# EAGLE design picotouch_synth_flip (EAGLE 9.6.2)
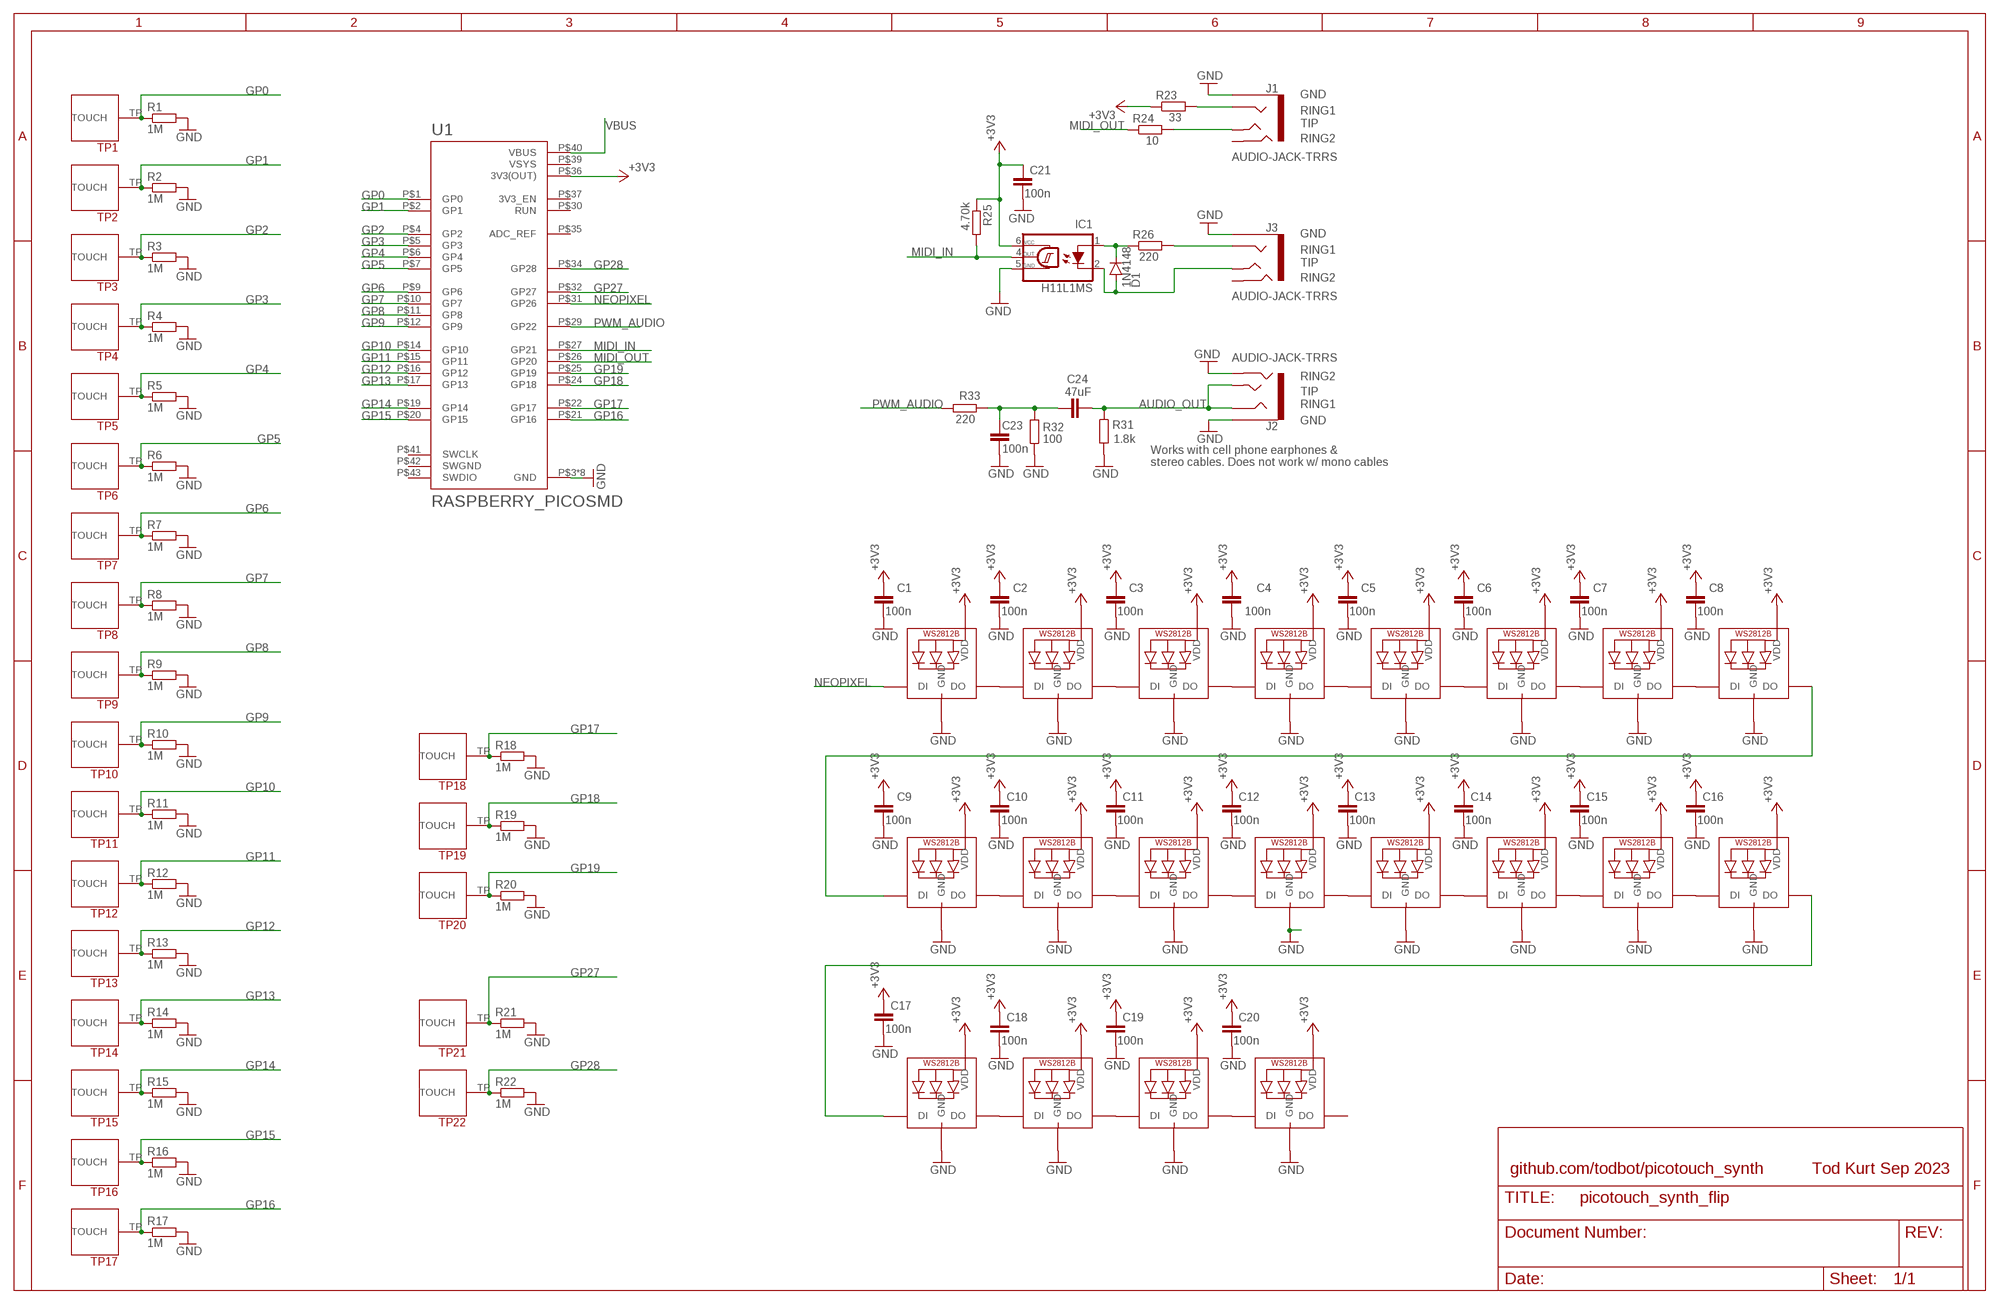
[diagram p0: schematic, sheet 1]

## Parts
C1  100n  C-EUC0603  [C0603]
C2  100n  C-EUC0603  [C0603]
C3  100n  C-EUC0603  [C0603]
C4  100n  C-EUC0603  [C0603]
C5  100n  C-EUC0603  [C0603]
C6  100n  C-EUC0603  [C0603]
C7  100n  C-EUC0603  [C0603]
C8  100n  C-EUC0603  [C0603]
C9  100n  C-EUC0603  [C0603]
C10  100n  C-EUC0603  [C0603]
C11  100n  C-EUC0603  [C0603]
C12  100n  C-EUC0603  [C0603]
C13  100n  C-EUC0603  [C0603]
C14  100n  C-EUC0603  [C0603]
C15  100n  C-EUC0603  [C0603]
C16  100n  C-EUC0603  [C0603]
C17  100n  C-EUC0603  [C0603]
C18  100n  C-EUC0603  [C0603]
C19  100n  C-EUC0603  [C0603]
C20  100n  C-EUC0603  [C0603]
C21  100n  C-EUC0603  [C0603]
C23  100n  C-EUC0603  [C0603]
C24  47uF  C-EUC0603  [C0603]
D1  1N4148  DIODE-SOD123  [SOD123]
IC1  H11L1MS  [DIL6-SMD]
J1  AUDIO-JACK-TRRS  [PJ-320D_SPARKFUN]
J2  AUDIO-JACK-TRRS  [PJ-320D_SPARKFUN]
J3  AUDIO-JACK-TRRS  [PJ-320D_SPARKFUN]
LED1  MICROBUILDER_WS2812B_SK6812E  [MICROBUILDER_NEO3535_REVERSE]
LED2  MICROBUILDER_WS2812B_SK6812E  [MICROBUILDER_NEO3535_REVERSE]
LED3  MICROBUILDER_WS2812B_SK6812E  [MICROBUILDER_NEO3535_REVERSE]
LED4  MICROBUILDER_WS2812B_SK6812E  [MICROBUILDER_NEO3535_REVERSE]
LED5  MICROBUILDER_WS2812B_SK6812E  [MICROBUILDER_NEO3535_REVERSE]
LED6  MICROBUILDER_WS2812B_SK6812E  [MICROBUILDER_NEO3535_REVERSE]
LED7  MICROBUILDER_WS2812B_SK6812E  [MICROBUILDER_NEO3535_REVERSE]
LED8  MICROBUILDER_WS2812B_SK6812E  [MICROBUILDER_NEO3535_REVERSE]
LED9  MICROBUILDER_WS2812B_SK6812E  [MICROBUILDER_NEO3535_REVERSE]
LED10  MICROBUILDER_WS2812B_SK6812E  [MICROBUILDER_NEO3535_REVERSE]
LED11  MICROBUILDER_WS2812B_SK6812E  [MICROBUILDER_NEO3535_REVERSE]
LED12  MICROBUILDER_WS2812B_SK6812E  [MICROBUILDER_NEO3535_REVERSE]
LED13  MICROBUILDER_WS2812B_SK6812E  [MICROBUILDER_NEO3535_REVERSE]
LED14  MICROBUILDER_WS2812B_SK6812E  [MICROBUILDER_NEO3535_REVERSE]
LED15  MICROBUILDER_WS2812B_SK6812E  [MICROBUILDER_NEO3535_REVERSE]
LED16  MICROBUILDER_WS2812B_SK6812E  [MICROBUILDER_NEO3535_REVERSE]
LED17  MICROBUILDER_WS2812B_SK6812E  [MICROBUILDER_NEO3535_REVERSE]
LED18  MICROBUILDER_WS2812B_SK6812E  [MICROBUILDER_NEO3535_REVERSE]
LED19  MICROBUILDER_WS2812B_SK6812E  [MICROBUILDER_NEO3535_REVERSE]
LED20  MICROBUILDER_WS2812B_SK6812E  [MICROBUILDER_NEO3535_REVERSE]
R1  1M  R-EU_R0805  [R0805]
R2  1M  R-EU_R0805  [R0805]
R3  1M  R-EU_R0805  [R0805]
R4  1M  R-EU_R0805  [R0805]
R5  1M  R-EU_R0805  [R0805]
R6  1M  R-EU_R0805  [R0805]
R7  1M  R-EU_R0805  [R0805]
R8  1M  R-EU_R0805  [R0805]
R9  1M  R-EU_R0805  [R0805]
R10  1M  R-EU_R0805  [R0805]
R11  1M  R-EU_R0805  [R0805]
R12  1M  R-EU_R0805  [R0805]
R13  1M  R-EU_R0805  [R0805]
R14  1M  R-EU_R0805  [R0805]
R15  1M  R-EU_R0805  [R0805]
R16  1M  R-EU_R0805  [R0805]
R17  1M  R-EU_R0805  [R0805]
R18  1M  R-EU_R0603  [R0603]
R19  1M  R-EU_R0603  [R0603]
R20  1M  R-EU_R0603  [R0603]
R21  1M  R-EU_R0603  [R0603]
R22  1M  R-EU_R0603  [R0603]
R23  33  R-EU_R0603  [R0603]
R24  10  R-EU_R0603  [R0603]
R25  4.70k  R-EU_R0603  [R0603]
R26  220  R-EU_R0603  [R0603]
R31  1.8k  R-EU_R0603  [R0603]
R32  100  R-EU_R0603  [R0603]
R33  220  R-EU_R0603  [R0603]
TP1  TOUCHPADA  [TOUCHPADA]
TP2  TOUCHPADA  [TOUCHPADA]
TP3  TOUCHPADA  [TOUCHPADA]
TP4  TOUCHPADA  [TOUCHPADA]
TP5  TOUCHPADA  [TOUCHPADA]
TP6  TOUCHPADA  [TOUCHPADA]
TP7  TOUCHPADA  [TOUCHPADA]
TP8  TOUCHPADA  [TOUCHPADA]
TP9  TOUCHPADA  [TOUCHPADA]
TP10  TOUCHPADA  [TOUCHPADA]
TP11  TOUCHPADA  [TOUCHPADA]
TP12  TOUCHPADA  [TOUCHPADA]
TP13  TOUCHPADA  [TOUCHPADA]
TP14  TOUCHPADA  [TOUCHPADA]
TP15  TOUCHPADA  [TOUCHPADA]
TP16  TOUCHPADA  [TOUCHPADA]
TP17  TOUCHPADA  [TOUCHPADA]
TP18  TOUCHPADB  [TOUCHPADB]
TP19  TOUCHPADB  [TOUCHPADB]
TP20  TOUCHPADB  [TOUCHPADB]
TP21  TOUCHPADB  [TOUCHPADB]
TP22  TOUCHPADB  [TOUCHPADB]
U1  RASPBERRY_PICOSMD  [PICO-PKG-SMD]

## Nets
+3V3: C1.1 C2.1 C3.1 C4.1 C5.1 C6.1 C7.1 C8.1 C9.1 C10.1 C11.1 C12.1 C13.1 C14.1 C15.1 C16.1 C17.1 C18.1 C19.1 C20.1 C21.1 IC1.6(VCC) LED1.1-VDD(VDD) LED2.1-VDD(VDD) LED3.1-VDD(VDD) LED4.1-VDD(VDD) LED5.1-VDD(VDD) LED6.1-VDD(VDD) LED7.1-VDD(VDD) LED8.1-VDD(VDD) LED9.1-VDD(VDD) LED10.1-VDD(VDD) LED11.1-VDD(VDD) LED12.1-VDD(VDD) LED13.1-VDD(VDD) LED14.1-VDD(VDD) LED15.1-VDD(VDD) LED16.1-VDD(VDD) LED17.1-VDD(VDD) LED18.1-VDD(VDD) LED19.1-VDD(VDD) LED20.1-VDD(VDD) R23.1 R25.1 U1.P$36(3V3(OUT))
AUDIO_OUT: C24.2 J2.RING1 J2.TIP R31.1
GND: C1.2 C2.2 C3.2 C4.2 C5.2 C6.2 C7.2 C8.2 C9.2 C10.2 C11.2 C12.2 C13.2 C14.2 C15.2 C16.2 C17.2 C18.2 C19.2 C20.2 C21.2 C23.2 IC1.5(GND) J1.EARTH J2.EARTH J2.RING2 J3.EARTH LED1.3-GND(GND) LED2.3-GND(GND) LED3.3-GND(GND) LED4.3-GND(GND) LED5.3-GND(GND) LED6.3-GND(GND) LED7.3-GND(GND) LED8.3-GND(GND) LED9.3-GND(GND) LED10.3-GND(GND) LED11.3-GND(GND) LED12.3-GND(GND) LED13.3-GND(GND) LED14.3-GND(GND) LED15.3-GND(GND) LED16.3-GND(GND) LED17.3-GND(GND) LED18.3-GND(GND) LED19.3-GND(GND) LED20.3-GND(GND) R1.2 R2.2 R3.2 R4.2 R5.2 R6.2 R7.2 R8.2 R9.2 R10.2 R11.2 R12.2 R13.2 R14.2 R15.2 R16.2 R17.2 R18.2 R19.2 R20.2 R21.2 R22.2 R31.2 R32.1 U1.P$3(GND) U1.P$8(GND) U1.P$13(GND) U1.P$18(GND) U1.P$23(GND) U1.P$28(GND) U1.P$33(GND) U1.P$38(GND)
GP0: R1.1 TP1.TP(TOUCH) U1.P$1(GP0)
GP1: R2.1 TP2.TP(TOUCH) U1.P$2(GP1)
GP2: R3.1 TP3.TP(TOUCH) U1.P$4(GP2)
GP3: R4.1 TP4.TP(TOUCH) U1.P$5(GP3)
GP4: R5.1 TP5.TP(TOUCH) U1.P$6(GP4)
GP5: R6.1 TP6.TP(TOUCH) U1.P$7(GP5)
GP6: R7.1 TP7.TP(TOUCH) U1.P$9(GP6)
GP7: R8.1 TP8.TP(TOUCH) U1.P$10(GP7)
GP8: R9.1 TP9.TP(TOUCH) U1.P$11(GP8)
GP9: R10.1 TP10.TP(TOUCH) U1.P$12(GP9)
GP10: R11.1 TP11.TP(TOUCH) U1.P$14(GP10)
GP11: R12.1 TP12.TP(TOUCH) U1.P$15(GP11)
GP12: R13.1 TP13.TP(TOUCH) U1.P$16(GP12)
GP13: R14.1 TP14.TP(TOUCH) U1.P$17(GP13)
GP14: R15.1 TP15.TP(TOUCH) U1.P$19(GP14)
GP15: R16.1 TP16.TP(TOUCH) U1.P$20(GP15)
GP16: R17.1 TP17.TP(TOUCH) U1.P$21(GP16)
GP17: R18.1 TP18.TP(TOUCH) U1.P$22(GP17)
GP18: R19.1 TP19.TP(TOUCH) U1.P$24(GP18)
GP19: R20.1 TP20.TP(TOUCH) U1.P$25(GP19)
GP27: R21.1 TP21.TP(TOUCH) U1.P$32(GP27)
GP28: R22.1 TP22.TP(TOUCH) U1.P$34(GP28)
MIDI_IN: IC1.4(OUT) R25.2 U1.P$27(GP21)
MIDI_OUT: R24.1 U1.P$26(GP20)
N$1: D1.C IC1.1(A) R26.1
N$2: J1.TIP R24.2
N$3: D1.A IC1.2(C) J3.TIP
N$4: J3.RING1 R26.2
N$5: C23.1 C24.1 R32.2 R33.1
N$6: J1.RING1 R23.2
N$7: LED1.2-DOUT(DO) LED2.4-DIN(DI)
N$8: LED2.2-DOUT(DO) LED3.4-DIN(DI)
N$9: LED4.2-DOUT(DO) LED5.4-DIN(DI)
N$10: LED5.2-DOUT(DO) LED6.4-DIN(DI)
N$11: LED6.2-DOUT(DO) LED7.4-DIN(DI)
N$12: LED7.2-DOUT(DO) LED8.4-DIN(DI)
N$13: LED9.2-DOUT(DO) LED10.4-DIN(DI)
N$14: LED10.2-DOUT(DO) LED11.4-DIN(DI)
N$15: LED12.2-DOUT(DO) LED13.4-DIN(DI)
N$16: LED13.2-DOUT(DO) LED14.4-DIN(DI)
N$17: LED14.2-DOUT(DO) LED15.4-DIN(DI)
N$18: LED15.2-DOUT(DO) LED16.4-DIN(DI)
N$19: LED3.2-DOUT(DO) LED4.4-DIN(DI)
N$20: LED11.2-DOUT(DO) LED12.4-DIN(DI)
N$21: LED8.2-DOUT(DO) LED9.4-DIN(DI)
N$22: LED16.2-DOUT(DO) LED17.4-DIN(DI)
N$23: LED17.2-DOUT(DO) LED18.4-DIN(DI)
N$24: LED18.2-DOUT(DO) LED19.4-DIN(DI)
N$25: LED19.2-DOUT(DO) LED20.4-DIN(DI)
NEOPIXEL: LED1.4-DIN(DI) U1.P$31(GP26)
PWM_AUDIO: R33.2 U1.P$29(GP22)
VBUS: U1.P$40(VBUS)
Unconnected: J1.RING2 J3.RING2 LED20.2-DOUT(DO) U1.P$30(RUN) U1.P$35(ADC_REF) U1.P$37(3V3_EN) U1.P$41(SWCLK) U1.P$43(SWDIO)

## Notes on the sheet
- GND
- RING1
- TIP
- RING2
- GND
- RING1
- TIP
- RING2
- RING2
- TIP
- RING1
- GND
- Works with cell phone earphones &
  stereo cables. Does not work w/ mono cables
- github.com/todbot/picotouch_synth | Tod Kurt Sep 2023

## Power pins joined to a net without a drawn wire
SWGND: U1.P$42(SWGND)
VSYS: U1.P$39(VSYS)

## Library data of the parts
C1-C21 C23 C24 = rcl:C-EU: CAPACITOR, European symbol; SPICEPREFIX: C
D1 = diode:DIODE-: DIODE
IC1 = optocoupler:H11L*M: 6-Pin DIP Optocoupler Source: http://www.fairchildsemi.com/ds/H1/H11L2-M.pdf; LCSC: C78589; MPN2: H11L1S; OC_FARNELL: unknown; OC_NEWARK: unknown
J1-J3 = audio_jacks_todbot:AUDIO-JACK-TRRS; LCSC: C431535; MPN: PJ-320D
LED1-LED20 = Adafruit MacroPad 2040:MICROBUILDER_WS2812B
R1-R26 R31-R33 = rcl:R-EU_: RESISTOR, European symbol; SPICEPREFIX: R
TP1-TP22 = todstuff:TOUCHPAD
U1 = RpiPico:RASPBERRY_PICO: Raspberry Pi Pico

## Net classes
1 power: width 0.305 mm

## Board
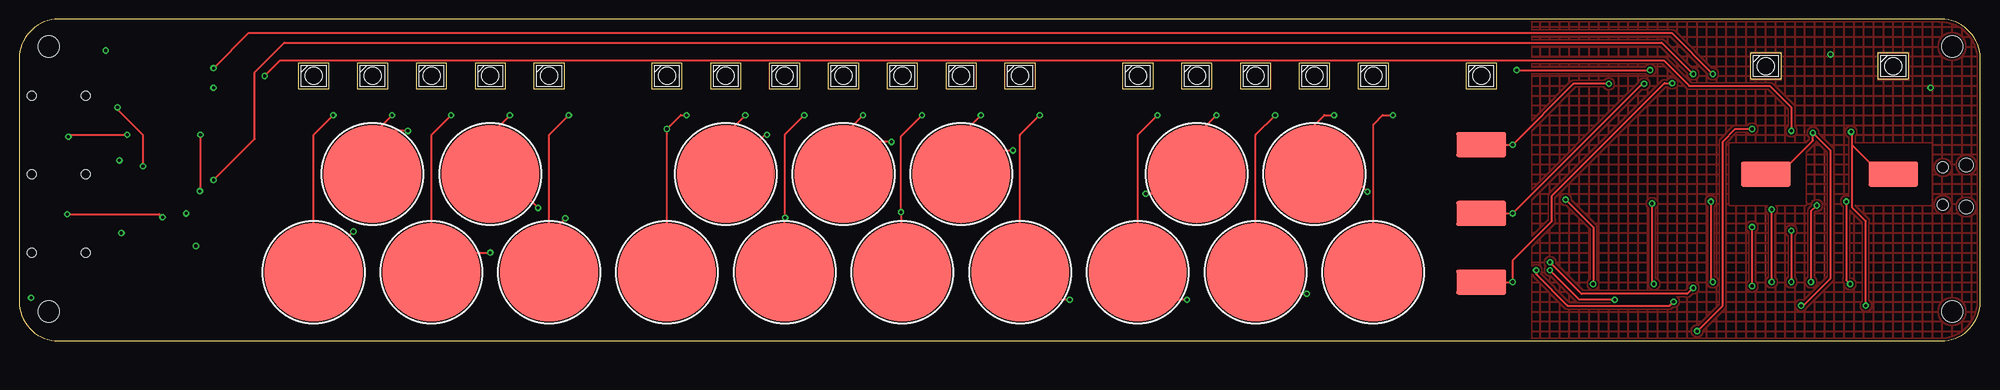
[diagram p1: board, top side]
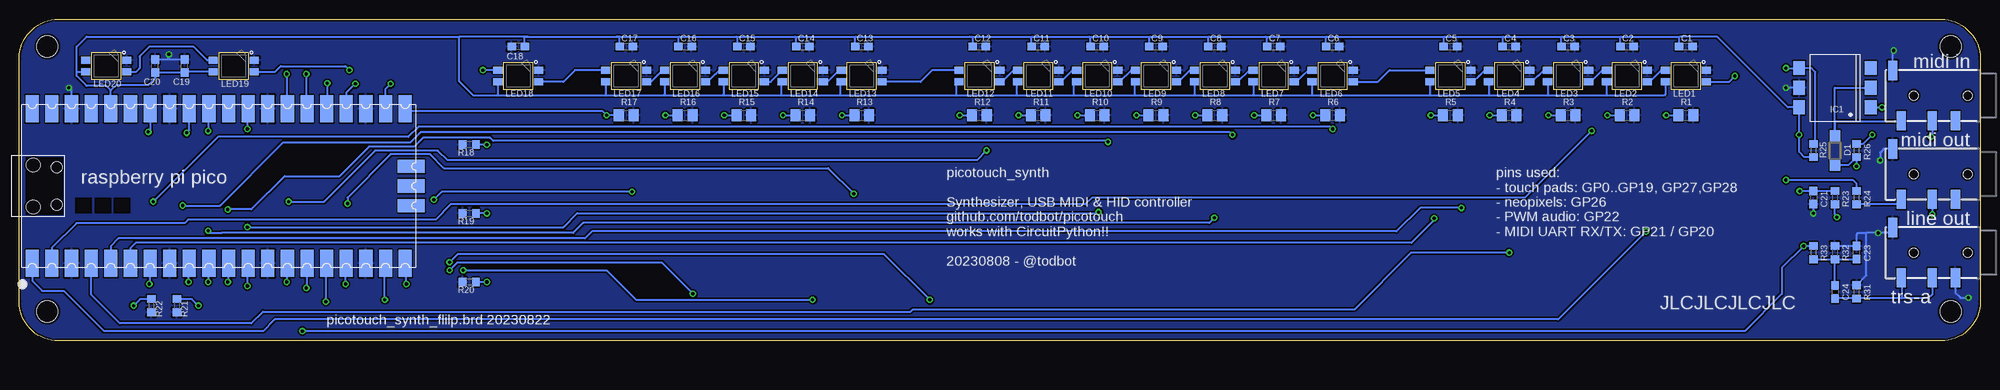
[diagram p2: board, bottom side, seen from below]

Size 253.81 x 41.62 mm. Coordinates in mm from the lower left corner, seen from the top.
Outline: 248.73,41.62 5.08,41.62 arc90 0,36.54 0,5.08 arc90 5.08,0 248.73,0 arc90 253.81,5.08 253.81,36.54 arc90 248.73,41.62
Copper layers (1*16): Top 0.035mm / dielectric 1.5mm / Bottom 0.035mm
Design rules "adafruit-rules-20180530 *": minimum track width 10mil, minimum drill 16mil, track to track 8mil, track to pad 8mil, pad to pad 8mil, via to via 8mil, smd to smd 8mil, copper to edge 10mil, drill to drill 8mil, minimum pad ring 10mil, minimum via ring 8mil, stop-mask expansion 4mil, vias tented up to drill 20mil, thermal gap 10mil
Holes 2.79 mm at 250.19,38.1 250.19,3.81 3.81,38.1 3.81,3.81
tRestrict: area 237.7,17.8 to 247.4,25.4; area 221.5,17.8 to 231.1,25.4

### Footprints (pad centres in the part's own frame; a part is rotated, then mirrored left to right if it is on the bottom)
C0603 = smd 1.1 x 1: 1 -0.85,0; 2 0.85,0
SOD123 = smd 1.4 x 1.4: A 1.9,0; C -1.9,0
DIL6-SMD = smd 1.78 x 1.52: 1 -2.54,-4.645; 2 0,-4.645; 3 2.54,-4.645; 4 2.54,4.645; 5 0,4.645; 6 -2.54,4.645
PJ-320D_SPARKFUN = smd 1.2 x 2.5: EARTH 11.3,-3.25; RING1 6.2,3.25; RING2 3.2,3.25; TIP 10.2,3.25 | hole 1.2: 1.6,0; 8.6,0
MICROBUILDER_NEO3535_REVERSE = smd 1.2 x 0.9 bottom: 1-VDD 2.65,-0.75; 2-DOUT 2.65,0.75; 3-GND -2.65,0.75; 4-DIN -2.65,-0.75
R0805 = smd 1.3 x 1.5: 1 -0.95,0; 2 0.95,0
R0603 = smd 1 x 1.1: 1 -0.85,0; 2 0.85,0
TOUCHPADA = smd 12.7 x 12.7: TP 0,0
TOUCHPADB = smd 6.452 x 3.251: TP 0,0
PICO-PKG-SMD = smd 3.5 x 1.7: P$1 -10,24.13; P$2 -10,21.59; P$3 -10,19.05; P$4 -10,16.51; P$5 -10,13.97; P$6 -10,11.43; P$7 -10,8.89; P$8 -10,6.35; P$9 -10,3.81; P$10 -10,1.27; P$11 -10,-1.27; P$12 -10,-3.81; P$13 -10,-6.35; P$14 -10,-8.89; P$15 -10,-11.43; P$16 -10,-13.97; P$17 -10,-16.51; P$18 -10,-19.05; P$19 -10,-21.59; P$20 -10,-24.13; P$21 10,-24.13; P$22 10,-21.59; P$23 10,-19.05; P$24 10,-16.51; P$25 10,-13.97; P$26 10,-11.43; P$27 10,-8.89; P$28 10,-6.35; P$29 10,-3.81; P$30 10,-1.27; P$31 10,1.27; P$32 10,3.81; P$33 10,6.35; P$34 10,8.89; P$35 10,11.43; P$36 10,13.97; P$37 10,16.51; P$38 10,19.05; P$39 10,21.59; P$40 10,24.13 | smd 1.7 x 3.5: P$41 -2.54,-24.925; P$42 0,-24.925; P$43 2.54,-24.925 | hole 1.8: -2.725,24; 2.725,24 | hole 1.5: -2.425,20.97; 2.425,20.97

### Placement (x,y rotation side)
C1  38.1,38.1 0 bottom
C2  45.72,38.1 0 bottom
C3  53.34,38.1 0 bottom
C4  60.96,38.1 0 bottom
C5  68.58,38.1 0 bottom
C6  83.82,38.1 0 bottom
C7  91.44,38.1 0 bottom
C8  99.06,38.1 0 bottom
C9  106.68,38.1 0 bottom
C10  114.3,38.1 0 bottom
C11  121.92,38.1 0 bottom
C12  129.54,38.1 0 bottom
C13  144.78,38.1 0 bottom
C14  152.4,38.1 0 bottom
C15  160.02,38.1 0 bottom
C16  167.64,38.1 0 bottom
C17  175.26,38.1 0 bottom
C18  189.23,38.1 180 bottom
C19  232.41,35.56 90 bottom
C20  236.22,35.56 90 bottom
C21  21.59,18.54 270 bottom
C23  16,11.43 90 bottom
C24  18.8,6.35 270 bottom
D1  18.8,24.64 90 bottom
IC1  18.8,32.77 90 bottom
J1  0,21.59 180 bottom
J2  0,11.43 180 bottom
J3  0,31.75 180 bottom
LED1  38.1,34.29 0 top
LED2  45.72,34.29 0 top
LED3  53.34,34.29 0 top
LED4  60.96,34.29 0 top
LED5  68.58,34.29 0 top
LED6  83.82,34.29 0 top
LED7  91.44,34.29 0 top
LED8  99.06,34.29 0 top
LED9  106.68,34.29 0 top
LED10  114.3,34.29 0 top
LED11  121.92,34.29 0 top
LED12  129.54,34.29 0 top
LED13  144.78,34.29 0 top
LED14  152.4,34.29 0 top
LED15  160.02,34.29 0 top
LED16  167.64,34.29 0 top
LED17  175.26,34.29 0 top
LED18  189.23,34.29 0 top
LED19  226.06,35.56 0 top
LED20  242.57,35.56 0 top
R1  38.1,29.21 0 bottom
R2  45.72,29.21 0 bottom
R3  53.34,29.21 0 bottom
R4  60.96,29.21 0 bottom
R5  68.58,29.21 0 bottom
R6  83.82,29.21 0 bottom
R7  91.44,29.21 0 bottom
R8  99.06,29.21 0 bottom
R9  106.68,29.21 0 bottom
R10  114.3,29.21 0 bottom
R11  121.92,29.21 0 bottom
R12  129.54,29.21 0 bottom
R13  144.78,29.21 0 bottom
R14  152.4,29.21 0 bottom
R15  160.02,29.21 0 bottom
R16  167.64,29.21 0 bottom
R17  175.26,29.21 0 bottom
R18  195.58,25.4 180 bottom
R19  195.58,16.51 180 bottom
R20  195.58,7.62 180 bottom
R21  233.43,4.57 270 bottom
R22  236.73,4.57 270 bottom
R23  18.8,18.54 270 bottom
R24  16,18.54 270 bottom
R25  21.59,24.64 90 bottom
R26  16,24.64 90 bottom
R31  16,6.35 90 bottom
R32  18.8,11.43 270 bottom
R33  21.59,11.43 90 bottom
TP1  38.1,8.89 0 top
TP2  45.72,21.59 0 top
TP3  53.34,8.89 0 top
TP4  60.96,21.59 0 top
TP5  68.58,8.89 0 top
TP6  83.82,8.89 0 top
TP7  91.44,21.59 0 top
TP8  99.06,8.89 90 top
TP9  106.68,21.59 0 top
TP10  114.3,8.89 0 top
TP11  121.92,21.59 0 top
TP12  129.54,8.89 0 top
TP13  144.78,8.89 0 top
TP14  152.4,21.59 0 top
TP15  160.02,8.89 0 top
TP16  167.64,21.59 0 top
TP17  175.26,8.89 0 top
TP18  189.23,25.4 0 top
TP19  189.23,16.51 0 top
TP20  189.23,7.62 0 top
TP21  226.06,21.59 0 top
TP22  242.57,21.59 0 top
U1  228,20.05 90 bottom

### Tracks (layer width: path | path; a pad name or v marks a point on that pad's centre or on a via)
+3V3  (via drill 0.41)
  Top 0.254: v23.44,26.67 23.44,19.46 v23.37,19.39
  Bottom 0.254: 48.26,31.75 44.7,31.75 40.89,31.75 40.75,31.89 LED1.1-VDD | 48.26,31.75 52.07,31.75 55.88,31.75 | 63.5,31.75 59.69,31.75 55.88,31.75 | 63.5,31.75 67.31,31.75 71.12,31.75 | 71.12,31.75 82.55,31.75 86.36,31.75 | 86.36,31.75 90.17,31.75 93.98,31.75 | 93.98,31.75 97.79,31.75 101.6,31.75 | 101.6,31.75 105.41,31.75 109.47,31.75 | 109.47,31.75 113.03,31.75 117.35,31.75 | 117.35,31.75 124.71,31.75 | 124.71,31.75 132.59,31.75 | 162.56,31.75 166.37,31.75 170.18,31.75 | 170.18,31.75 173.99,31.75 177.8,31.75 | 177.8,31.75 191.77,31.75 | 191.77,31.75 194.98,31.75 196.85,33.62 196.85,39.37 | R23.1 C21.1 v23.37,19.39 | R25.1 22.77,23.79 23.44,24.46 v23.44,26.67 IC1.6 24.89,30.23 29.72,35.05 34.04,39.37 38.86,39.37 | C18.1 188.38,39.37 187.96,39.37 | 187.96,39.37 176.53,39.37 | 176.53,39.37 168.4,39.37 | 168.4,39.37 161.04,39.37 | 161.04,39.37 153.42,39.37 | 153.42,39.37 145.54,39.37 | 145.54,39.37 130.81,39.37 130.56,39.37 | 130.56,39.37 122.68,39.37 | 122.68,39.37 115.32,39.37 | 115.32,39.37 107.44,39.37 | 107.44,39.37 99.82,39.37 | 99.82,39.37 92.46,39.37 | 92.46,39.37 84.58,39.37 | 84.58,39.37 69.34,39.37 | 69.34,39.37 61.72,39.37 | 61.72,39.37 54.1,39.37 | 54.1,39.37 46.48,39.37 | 46.48,39.37 38.86,39.37 | C17.1 176.11,39.37 176.53,39.37 | LED20.1-VDD 246.38,34.81 246.38,35.56 | 187.96,39.37 196.85,39.37 | 196.85,39.37 245.11,39.37 246.38,38.1 246.38,35.56 | U1.P$36 241.97,32.42 | 241.97,32.42 242.22,32.67 242.57,33.02 245.11,33.02 246.38,34.29 246.38,35.56 | C1.1 38.95,39.28 38.86,39.37 | C2.1 46.57,39.28 46.48,39.37 | C3.1 54.19,39.28 54.1,39.37 | C4.1 61.81,39.28 61.72,39.37 | C5.1 69.43,39.28 69.34,39.37 | C13.1 145.63,39.28 145.54,39.37
  Bottom 0.254: C14.1 153.25,39.2 153.42,39.37 | C16.1 168.49,39.28 168.4,39.37 | C15.1 160.87,39.2 161.04,39.37 | LED18.1-VDD 191.88,31.86 191.77,31.75 | LED17.1-VDD 177.91,31.86 177.8,31.75 | LED16.1-VDD 170.29,31.86 170.18,31.75 | LED15.1-VDD 162.67,31.86 162.56,31.75 | LED4.1-VDD 63.61,31.86 63.5,31.75 | LED3.1-VDD 55.99,31.86 55.88,31.75 | LED2.1-VDD 48.37,31.86 48.26,31.75 | LED5.1-VDD 71.23,31.86 71.12,31.75 | LED6.1-VDD 86.47,31.86 86.36,31.75 | LED7.1-VDD 94.09,31.86 93.98,31.75 | LED8.1-VDD 101.71,31.86 101.6,31.75 | C8.1 99.91,39.28 99.82,39.37 | C7.1 92.29,39.2 92.46,39.37 | C10.1 115.15,39.2 115.32,39.37 | C6.1 84.67,39.28 84.58,39.37 | LED9.1-VDD 109.47,33.4 109.47,31.75 | LED10.1-VDD 117.35,33.14 117.35,31.75 | LED11.1-VDD 124.71,33.4 124.71,31.75 | LED12.1-VDD 132.59,33.14 132.59,31.75 | C12.1 130.39,39.2 130.56,39.37 | C11.1 122.77,39.28 122.68,39.37 | C9.1 107.53,39.28 107.44,39.37 | 132.59,31.75 147.57,31.75 | 147.57,31.75 155.19,31.75 | 155.19,31.75 162.56,31.75 | LED13.1-VDD 147.57,33.4 147.57,31.75 | LED14.1-VDD 155.19,33.4 155.19,31.75 | LED19.1-VDD 232.31,34.81 C19.1 C20.1 236.22,34.01 237.05,33.18 241.21,33.18 241.97,32.42
AUDIO_OUT
  Bottom 0.254: J2.RING1 6.2,5.99 6.69,5.5 10.16,5.5 | J2.TIP 10.16,8.14 10.16,5.5 | 10.16,5.5 R31.1 C24.2
GND  (via drill 0.41)
  Bottom 0.254: J2.EARTH 11.3,14.1 11.43,13.97 14.73,13.97 | R32.1 C23.2 16,13.72 15.75,13.97 14.73,13.97 | J3.EARTH 11.3,37.59 v11.18,37.59 | J2.RING2 3.2,6.25 2.54,5.59 v1.52,5.59 | R31.2 14.73,8.47 14.73,13.97 | IC1.5 v25.15,32.77 | C21.2 v21.59,16.51 | U1.P$38 247.05,32.42 v247.4,32.77 | C19.2 234.44,36.41 | 234.44,36.41 C20.2 | 234.44,36.41 v234.44,37.08 | J1.EARTH 12.5,24.84 12.95,24.38 v12.95,23.37
  other vias: 13.21,13.97
  pour Top (hatched): 195.85,43.13 254.02,43.13 254.02,-0.73 195.85,-0.73
  pour Bottom: 0,44.45 255.27,44.45 255.27,-2.54 0,-2.54
GP0  (via drill 0.41)
  Top 0.254: v43.24,14.16 38.03,8.96 TP1.TP 38.1,26.67 v40.64,29.21
  Bottom 0.254: v43.24,14.16 54.61,2.79 220.73,2.79 222.25,1.27 242.82,1.27 248.05,6.49 250.86,6.49 252.13,7.76 U1.P$1 | v40.64,29.21 R1.1
GP1  (via drill 0.41)
  Top 0.254: v50.29,27.18 48.26,27.18 45.72,24.64 TP2.TP 45.72,26.67 v48.26,29.21
  Bottom 0.254: v50.29,27.18 58.93,18.54 114.96,18.54 115.84,17.66 197.98,17.66 199.95,15.7 231.95,15.7 232.41,15.24 246.38,15.24 249.59,12.03 U1.P$2 | v48.26,29.21 R2.1
GP2  (via drill 0.41)
  Top 0.254: v60.96,11.43 55.88,11.43 TP3.TP 53.34,26.67 v55.88,29.21
  Bottom 0.254: v60.96,11.43 73.66,11.43 81.03,4.06 138.18,4.06 138.43,3.81 222.25,3.81 223.77,2.29 240.79,2.29 244.51,6 U1.P$4 | v55.88,29.21 R3.1
GP3  (via drill 0.41)
  Top 0.254: v67.15,17.21 62.78,21.59 TP4.TP 60.96,26.67 v63.5,29.21
  Bottom 0.254: U1.P$5 241.97,12.28 241,13.26 180.58,13.26 179.68,14.17 75.54,14.17 72.49,17.21 v67.15,17.21 | v63.5,29.21 R4.1
GP4  (via drill 0.41)
  Top 0.254: v70.69,15.87 68.53,13.72 68.77,13.72 68.77,9.08 TP5.TP 68.58,26.67 v71.12,29.21
  Bottom 0.254: v70.69,15.87 70.69,15.61 73.61,12.69 238.76,12.69 239.43,12.02 U1.P$6 | v71.12,29.21 R5.1
GP5  (via drill 0.41)
  Top 0.254: TP6.TP v83.82,27.43 85.6,29.21 v86.36,29.21 | v236.47,18.03 236.47,7.87 v236.98,7.37
  Bottom 0.254: v83.82,27.43 84.13,27.74 202.13,27.74 203.45,26.42 228.09,26.42 v236.47,18.03 | v236.98,7.37 236.89,7.46 U1.P$7 | v86.36,29.21 R6.1
GP6  (via drill 0.41)
  Top 0.254: v232.66,17.53 231.9,16.76 v231.9,7.62 | v93.98,29.21 91.44,26.67 TP7.TP 96.52,26.67 v96.77,26.67
  Bottom 0.254: v96.77,26.67 97.11,27.01 201.85,27.01 203.2,25.65 219.71,25.65 227.84,17.53 v232.66,17.53 | R7.1 92.46,29.28 92.52,29.21 v93.98,29.21 | v231.9,7.62 231.9,9.96 U1.P$9
GP7  (via drill 0.41)
  Top 0.254: TP8.TP 99.06,15.86 v99.13,15.93 99.13,26.74 v101.6,29.21 | v229.36,14.25 v229.36,7.62
  Bottom 0.254: v99.13,15.93 99.77,15.29 180.8,15.29 182.12,13.97 227.58,13.97 229.08,13.97 v229.36,14.25 | v229.36,7.62 229.27,7.71 U1.P$10 | v101.6,29.21 R8.1
GP8  (via drill 0.41)
  Top 0.254: v112.89,25.75 108.87,25.75 106.81,27.81 106.68,27.69 TP9.TP 106.68,26.67 v109.22,29.21 | v226.82,7.62 v226.82,17.02
  Bottom 0.254: v112.89,25.75 113.02,25.88 192.48,25.88 192.88,26.28 201.56,26.28 202.69,25.15 208.53,25.15 212.34,21.34 219.46,21.34 223.77,17.02 v226.82,17.02 | v226.82,7.62 226.73,7.71 U1.P$11 | v109.22,29.21 R9.1
GP9  (via drill 0.41)
  Top 0.254: TP10.TP 114.11,9.08 v114.11,16.67 114.11,26.48 v116.84,29.21 | v224.28,14.73 v224.28,7.11
  Bottom 0.254: R10.1 115.32,29.28 115.38,29.21 v116.84,29.21 | v224.28,14.73 183.39,14.73 181.58,16.54 114.25,16.54 v114.11,16.67 | v224.28,7.11 224.28,9.96 U1.P$12
GP10  (via drill 0.41)
  Top 0.254: v128.61,24.66 124.99,24.66 TP11.TP 121.92,26.67 v124.46,29.21 | v218.95,18.03 218.95,7.87 v219.2,7.62
  Bottom 0.254: v128.61,24.66 129.88,23.39 198.4,23.39 199.64,24.64 207.77,24.64 214.38,18.03 v218.95,18.03 | v219.2,7.62 219.11,7.71 U1.P$14 | v124.46,29.21 R11.1
GP11  (via drill 0.41)
  Top 0.254: v198.13,10.17 202.21,6.1 215.9,6.1 v216.66,6.86 | v135.96,5.32 133.11,5.32 TP12.TP 129.54,26.67 v132.08,29.21
  Bottom 0.254: v135.96,5.32 141.92,11.28 197.03,11.28 v198.13,10.17 | v216.66,6.86 216.57,6.95 U1.P$15 | v132.08,29.21 R12.1
GP12  (via drill 0.41)
  Top 0.254: v196.34,9.14 196.34,8.64 200.41,4.57 213.61,4.57 v214.12,5.08 | v151.13,5.33 148.34,5.33 TP13.TP 144.78,26.67 v147.32,29.21
  Bottom 0.254: v214.12,5.08 214.12,9.96 U1.P$16 | v196.34,9.14 177.8,9.14 173.99,5.33 v151.13,5.33 | v147.32,29.21 R13.1
GP13  (via drill 0.41)
  Top 0.254: 152.4,27.43 152.65,27.69 | 152.65,27.69 152.78,27.81 152.4,27.43 | 152.4,27.43 152.65,27.69 | TP14.TP 152.4,27.43 | TP14.TP 149.86,19.05 v145.8,19.05 | v211.33,17.78 211.33,7.62 v211.58,7.37 | TP14.TP 152.4,26.67 v154.94,29.21
  Bottom 0.254: v145.8,19.05 149.1,22.35 198.88,22.35 200.66,24.13 205.74,24.13 211.33,18.54 v211.33,17.78 | v211.58,7.37 211.58,9.96 U1.P$17 | v154.94,29.21 R14.1
GP14  (via drill 0.41)
  Top 0.254: v166.62,6.1 162.81,6.1 TP15.TP 160.02,26.67 v162.56,29.21 | v198.12,9.14 201.93,5.33 v206.5,5.33
  Bottom 0.254: v206.5,5.33 206.5,9.96 U1.P$19 | v166.62,6.1 170.69,10.16 197.1,10.16 v198.12,9.14 | v162.56,29.21 R15.1
GP15  (via drill 0.41)
  Top 0.254: v174.5,19.3 172.21,21.59 TP16.TP 167.64,27.94 168.91,29.21 v170.18,29.21 | v200.15,18.29 203.71,14.73 v203.71,7.37
  Bottom 0.254: v174.5,19.3 199.14,19.3 v200.15,18.29 | v203.71,7.37 203.71,9.89 U1.P$20 | v170.18,29.21 R16.1
GP16  (via drill 0.41)
  Top 0.254: TP17.TP 175.26,28.01 176.46,29.21 v177.8,29.21
  Bottom 0.254: R17.1 v177.8,29.21 178.31,29.72 203.54,29.72 U1.P$21
GP17  (via drill 0.41)
  Top 0.254: TP18.TP v193.29,25.4 201.17,33.27 v205.74,33.27
  Bottom 0.254: U1.P$22 206.41,32.6 v205.74,33.27 | v193.29,25.4 R18.1
GP18  (via drill 0.41)
  Top 0.254: v210.31,33.27 210.06,33.27 v193.29,16.51 TP19.TP
  Bottom 0.254: v210.31,33.27 211.49,32.1 U1.P$24 | v193.29,16.51 R19.1
GP19  (via drill 0.41)
  Top 0.254: TP20.TP v193.29,7.62 193.29,10.41 198.37,15.49 198.37,18.8 212.93,33.35 v213.95,33.35
  Bottom 0.254: v213.95,33.35 213.95,30.13 U1.P$25 | v193.29,7.62 R20.1
GP27  (via drill 0.41)
  Top 0.254: v230.63,4.57 230.89,4.57 234.44,8.13 234.44,24.64 v232.16,26.92 232.16,25.91 227.84,21.59 TP21.TP
  Bottom 0.254: v230.63,4.57 231.48,5.42 R21.1 | v232.16,26.92 231.81,27.27 U1.P$32
GP28  (via drill 0.41)
  Top 0.254: 237.21,25.4 237.21,26.95 v237.11,27.05 | 237.21,25.4 237.21,17.3 239.01,15.49 v239.01,4.57 | TP22.TP 241.02,21.59 237.21,25.4
  Bottom 0.254: U1.P$34 236.89,27.27 v237.11,27.05 | R22.1 238.16,5.42 v239.01,4.57
MIDI_IN  (via drill 0.41)
  Top 0.254: v25.15,35.31 29.72,39.88 213.87,39.88 v219.2,34.54
  Bottom 0.254: R25.2 21.34,25.74 21.34,34.8 21.84,35.31 IC1.4 v25.15,35.31 | v219.2,34.54 219.2,30.14 U1.P$27
MIDI_OUT  (via drill 0.41)
  Top 0.254: v25.15,20.83 30.48,26.16 30.48,34.8 34.29,38.61 212.6,38.61 v216.66,34.54
  Bottom 0.254: R24.1 16,20.32 16.51,20.83 v25.15,20.83 | v216.66,34.54 216.66,30.14 U1.P$26
N$1  (via drill 0.41)
  Top 0.254: v12.7,30.23 12.7,29.97 16,26.67 v16,22.61
  Bottom 0.254: D1.C 17.05,22.74 R26.1 v16,22.61 | IC1.1 v12.7,30.23
N$2
  Bottom 0.254: J1.TIP 10.85,17.69 R24.2
N$3
  Bottom 0.254: J3.TIP 10.3,28.4 18.71,28.4 18.8,28.32 D1.A 18.8,32.77 IC1.2
N$4  (via drill 0.41)
  Top 0.254: v6.35,26.42 6.6,26.67 v13.97,26.67
  Bottom 0.254: J3.RING1 6.2,26.57 v6.35,26.42 | R26.2 15.15,25.49 v13.97,26.67
N$5
  Bottom 0.254: R33.1 R32.2 | R32.2 C23.1 | C24.1 R32.2
N$6  (via drill 0.41)
  Top 0.254: v6.2,16.41 18.14,16.41 v18.54,16
  Bottom 0.254: J1.RING1 v6.2,16.41 | R23.2 18.8,16.42 18.54,16.17 v18.54,16
N$7
  Bottom 0.254: LED1.2-DOUT 41.27,35.04 42.77,33.54 LED2.4-DIN
N$8
  Bottom 0.254: LED2.2-DOUT 48.88,35.04 49.6,34.32 49.62,34.32 49.97,33.97 50.4,33.54 LED3.4-DIN
N$9
  Bottom 0.254: LED4.2-DOUT 64.12,35.04 64.84,34.32 64.86,34.32 65.64,33.54 LED5.4-DIN
N$10
  Bottom 0.254: LED6.4-DIN 77.97,33.54 76.47,35.04 LED5.2-DOUT
N$11
  Bottom 0.254: LED6.2-DOUT 86.98,35.04 87.7,34.32 87.72,34.32 88.5,33.54 LED7.4-DIN
N$12
  Bottom 0.254: LED7.2-DOUT 94.61,35.04 96.11,33.54 LED8.4-DIN
N$13
  Bottom 0.254: LED10.4-DIN 111.4,33.54 110.68,34.26 110.66,34.26 109.88,35.04 LED9.2-DOUT
N$14
  Bottom 0.254: LED11.4-DIN 119,33.54 117.5,35.04 LED10.2-DOUT
N$15
  Bottom 0.254: LED12.2-DOUT 135.65,35.04 137.15,33.54 LED13.4-DIN
N$16
  Bottom 0.254: LED14.4-DIN 149.22,33.54 147.72,35.04 LED13.2-DOUT
N$17
  Bottom 0.254: LED14.2-DOUT 155.77,34.32 155.79,34.32 156.57,33.54 LED15.4-DIN
N$18
  Bottom 0.254: LED15.2-DOUT 163.18,35.04 163.64,34.57 163.66,34.57 164.69,33.54 LED16.4-DIN
N$19
  Bottom 0.254: LED3.2-DOUT 56.5,35.04 57.22,34.32 57.23,34.32 58.02,33.54 LED4.4-DIN
N$20
  Bottom 0.254: LED12.4-DIN 126.64,33.54 125.92,34.26 125.9,34.26 125.12,35.04 LED11.2-DOUT
N$21
  Bottom 0.254: LED9.4-DIN 103.76,33.54 102.26,35.04 LED8.2-DOUT
N$22
  Bottom 0.254: LED16.2-DOUT 170.54,35.04 171.26,34.32 171.28,34.32 172.06,33.54 LED17.4-DIN
N$23
  Bottom 0.254: LED17.2-DOUT 181.88,35.04 183.38,33.54 LED18.4-DIN
N$24  (via drill 0.41)
  Top 0.254: v193.8,35.05 v211.07,35.05
  Bottom 0.254: LED18.2-DOUT v193.79,35.04 v193.8,35.05 | LED19.4-DIN 220.71,34.81 219.96,35.56 211.58,35.56 v211.07,35.05
N$25
  Bottom 0.254: LED19.2-DOUT 229.47,36.31 231.26,38.1 236.98,38.1 238.25,36.83 238.25,35.31 238.76,34.8 239.91,34.8 LED20.4-DIN
NEOPIXEL  (via drill 0.41)
  Top 0.254: v31.75,34.29 33.78,36.32 212.85,36.32 216.15,33.02 226.57,33.02 229.36,30.23 v229.36,27.18
  Bottom 0.254: LED1.4-DIN 32.5,33.54 v31.75,34.29 | v229.36,27.18 229.27,27.27 U1.P$31
PWM_AUDIO  (via drill 0.41)
  Top 0.254: v217.17,1.27 220.47,4.57 220.47,25.76 222.15,27.43 v224.28,27.43
  Bottom 0.254: R33.2 v22.86,12.28 25.65,9.49 25.65,6.1 30.48,1.27 v217.17,1.27 | v224.28,27.43 224.28,29.96 U1.P$29

### Text on the board
bPlace: midi in | midi out | raspberry pi pico | line out | pins used: / - touch pads: GP0..GP19, GP27,GP28 / - neopixels: GP26 / - PWM audio: GP22 / - MIDI UART RX/TX: GP21 / GP20 | picotouch_synth / / Synthesizer, USB MIDI & HID controller / github.com/todbot/picotouch / works with CircuitPython!! / / 20230808 - @todbot | trs-a | JLCJLCJLCJLC | picotouch_synth_flilp.brd 20230822